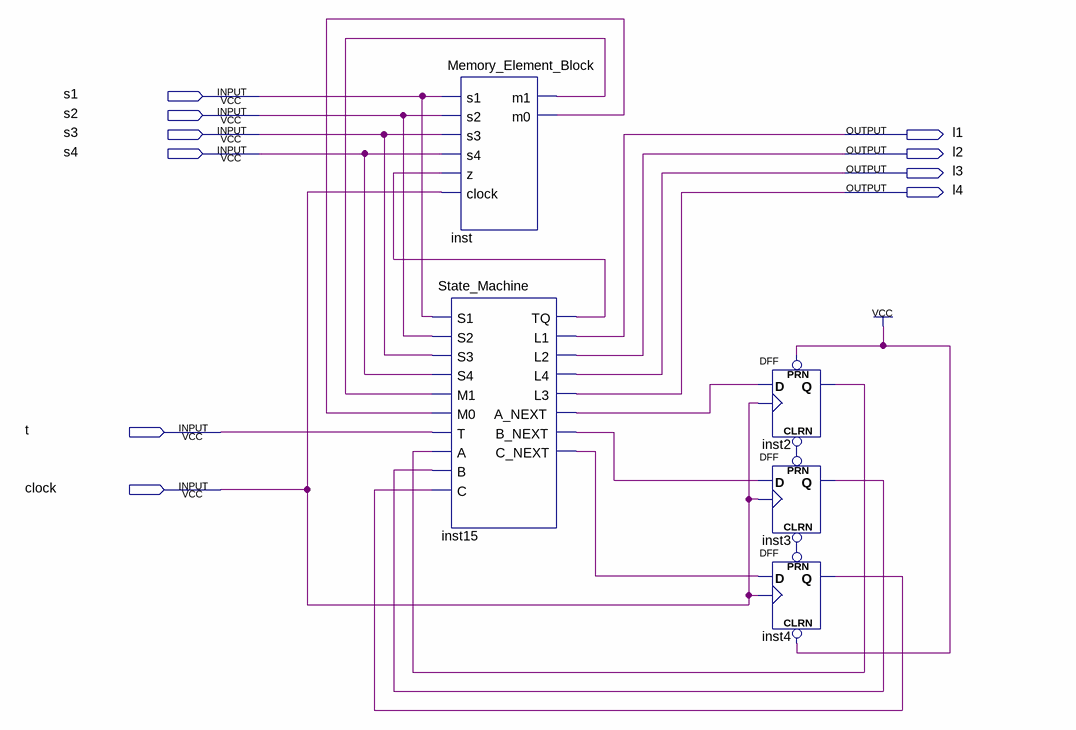
[diagram p0: schematic sheet]
// Quartus schematic Full_Diagram.bdf as structural Verilog: 5 symbols, 10 pins
module Full_Diagram (
  input  s1,
  input  s2,
  input  s3,
  input  s4,
  input  t,
  input  clock,
  output l1,
  output l2,
  output l3,
  output l4
);

  wire inst2_q, inst3_q, inst4_q, inst15_a_next, inst15_b_next, inst15_c_next, inst15_tq, inst_m0, inst_m1,
       undriven, undriven_2;

  Memory_Element_Block inst (
    .s1(s1), .s2(s2), .s3(s3), .s4(s4), .z(inst15_tq), .clock(clock), .m1(inst_m1), .m0(inst_m0));
  State_Machine inst15 (
    .S1(s1), .S2(s2), .S3(s3), .S4(s4), .M1(inst_m1), .M0(inst_m0), .T(t), .A(inst2_q), .B(inst3_q),
    .C(inst4_q), .TQ(inst15_tq), .L1(l1), .L2(l2), .L4(l3), .L3(l4), .A_NEXT(inst15_a_next),
    .B_NEXT(inst15_b_next), .C_NEXT(inst15_c_next));
  DFF inst2 (.CLRN(undriven), .CLK(clock), .D(inst15_a_next), .PRN(1'b1), .Q(inst2_q));
  DFF inst3 (.CLRN(undriven_2), .CLK(clock), .D(inst15_b_next), .PRN(undriven), .Q(inst3_q));
  DFF inst4 (.CLRN(1'b1), .CLK(clock), .D(inst15_c_next), .PRN(undriven_2), .Q(inst4_q));
endmodule
